# EAGLE board Protoboard MX3-11-8-ESP12 (EAGLE 7.7.0)
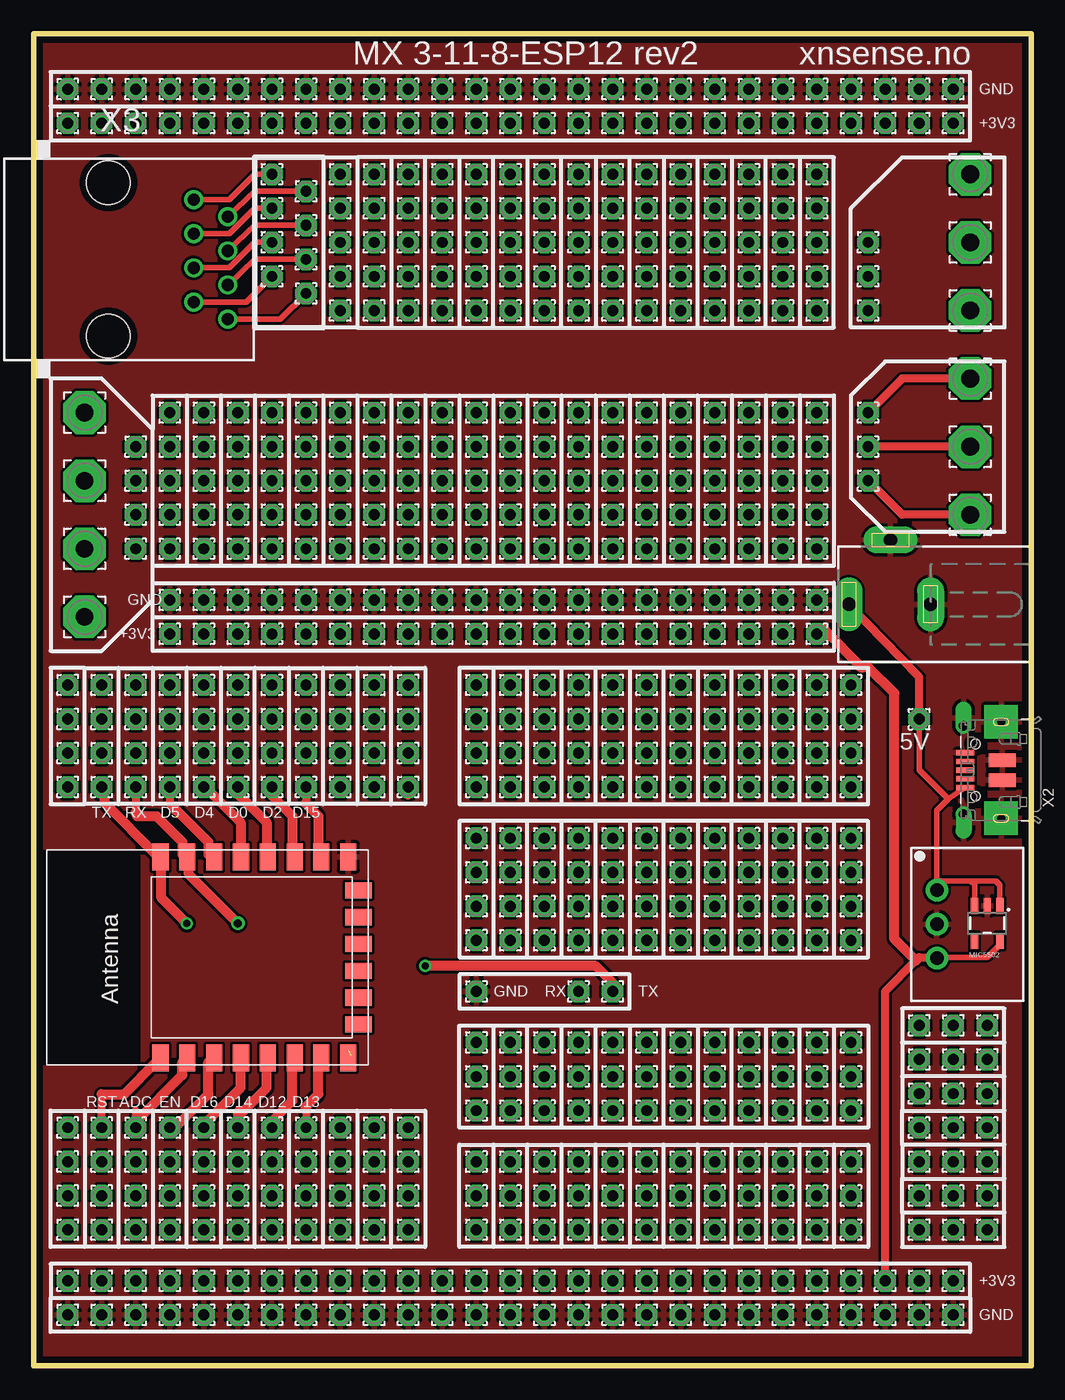
[diagram p1: board, top side]
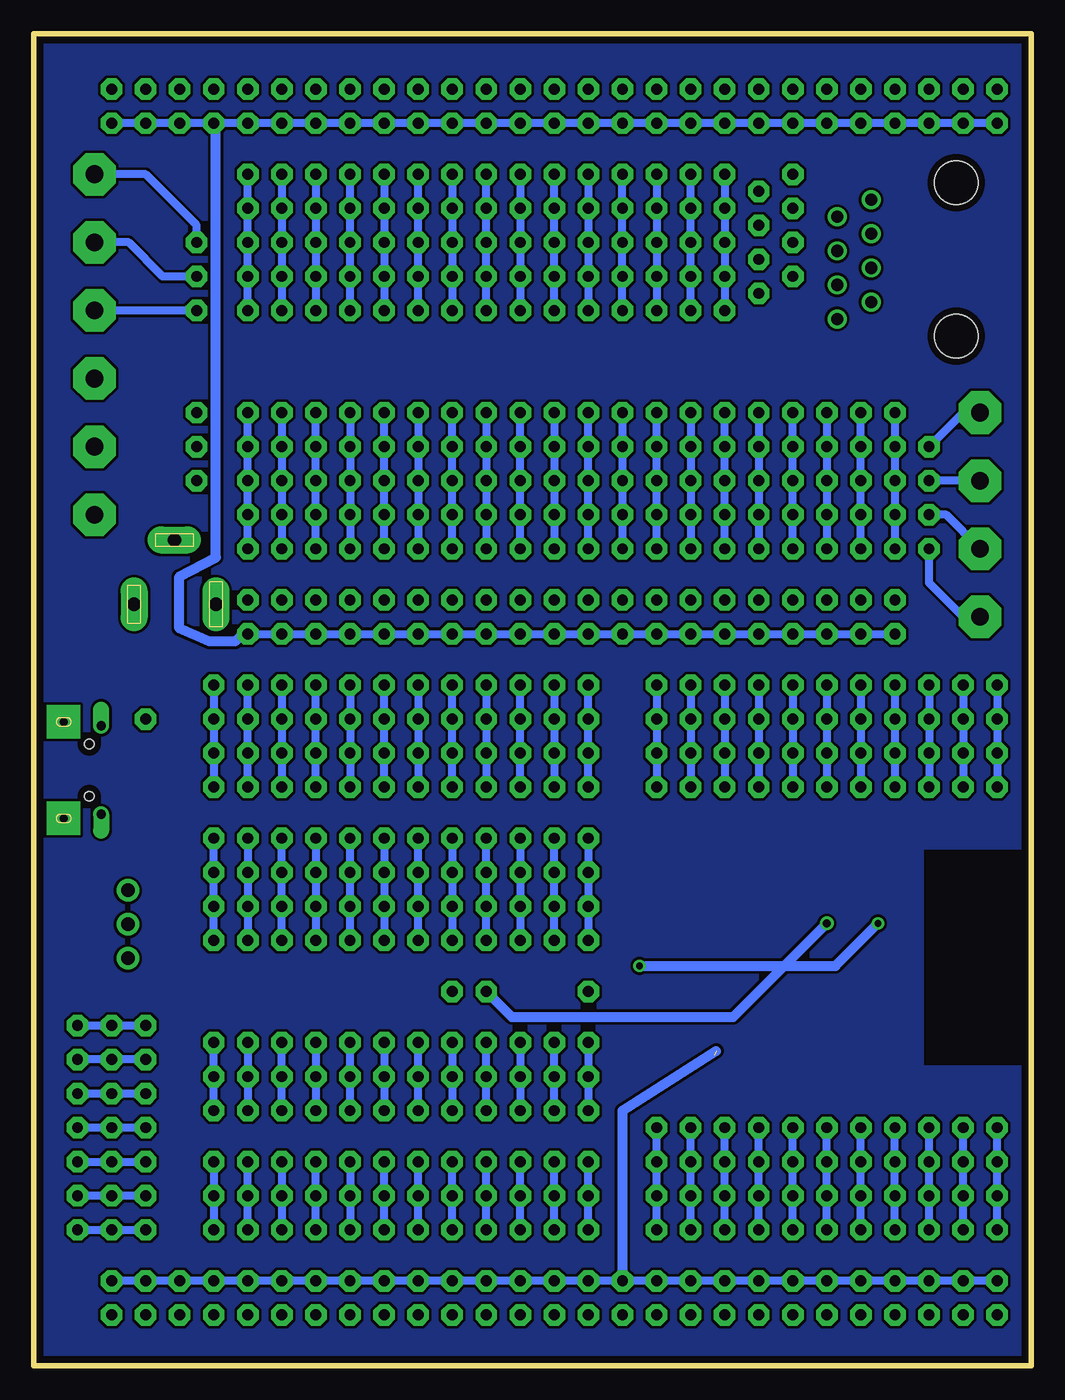
[diagram p2: board, bottom side, seen from below]

Size 74.4 x 99.4 mm. Coordinates in mm from the lower left corner, seen from the top.
Outline: 0,0 0,99.4 74.4,99.4 74.4,0 0,0
Copper layers (1*16): Top 0.035mm / dielectric 1.5mm / Bottom 0.035mm
Design rules "default *": minimum track width 30mil, minimum drill 20mil, track to track 8mil, track to pad 8mil, pad to pad 8mil, via to via 8mil, smd to smd 8mil, copper to edge 20mil, drill to drill 8mil, minimum pad ring 10mil, minimum via ring 8mil, stop-mask expansion 4mil, vias tented up to drill 0mil, thermal gap 10mil
Net classes: 0 default: width 0.61 mm, drill 0.508 mm, clearance 0.127 mm

## Footprints (pad centres in the part's own frame; a part is rotated, then mirrored left to right if it is on the bottom)
1,6/0,8 = drill 0.813 pad 1.6 octagon: 1 0,0
SIP3 = drill 1 pad 1.676: 1 -2.54,0; 2 0,0; 3 2.54,0
DCJ0202 = drill 1 pad 2 long: 1 0,3.1; 2 4.8,0; 3 0,-3
SOT23-5 = smd 0.55 x 1.2: 1 -0.95,-1.3; 2 0,-1.3; 3 0.95,-1.3; 4 0.95,1.3; 5 -0.95,1.3
3,17/1,3 = drill 1.321 pad 3.175 octagon: 1 0,0
ESP-12E = smd 2 x 1.2: 1 -7.5,5.77; 2 -7.5,3.77; 3 -7.5,1.77; 4 -7.5,-0.23; 5 -7.5,-2.23; 6 -7.5,-4.23; 7 -7.5,-6.23; 8 -7.5,-8.23; 9 7.5,-8.23; 10 7.5,-6.23; 11 7.5,-4.23; 12 7.5,-2.23; 13 7.5,-0.23; 14 7.5,1.77; 15 7.5,3.77; 16 7.5,5.77 | smd 1.2 x 2: 17 -5,-9; 18 -3,-9; 19 -1,-9; 20 1,-9; 21 3,-9; 22 5,-9
4UCONN_20329 = smd 1 x 2: BASE@1 -0.75,-2; BASE@2 0.75,-2 | smd 0.4 x 1.35: D+ 0,0.775; D- -0.65,0.775; GND 1.3,0.775; ID 0.65,0.775; VBUS -1.3,0.775 | drill 0.7 offset: SPRT@1 -3.3,0.9; SPRT@2 3.3,0.9 | drill 0.6 pad 2.5 square: SPRT@3 -3.6,-1.9; SPRT@4 3.6,-1.9 | hole 0.7: -1.95,0; 1.95,0
RJ45-NO-SHIELD = drill 0.9 pad 1.4: 1 -4.445,6.35; 2 -3.175,8.89; 3 -1.905,6.35; 4 -0.635,8.89; 5 0.635,6.35; 6 1.905,8.89; 7 3.175,6.35; 8 4.445,8.89 | hole 3.251: -5.715,0; 5.715,0

## Placement (x,y rotation side)
1  [1,6/0,8]  20.32,80.01 0 top
2  [1,6/0,8]  17.78,88.9 0 top
4  [1,6/0,8]  17.78,86.36 0 top
5  [1,6/0,8]  20.32,85.09 0 top
5V  [1,6/0,8]  66.04,48.26 180 top
6  [1,6/0,8]  17.78,83.82 0 top
7  [1,6/0,8]  20.32,82.55 0 top
8  [1,6/0,8]  17.78,81.28 0 top
DC  R-78C1.8-1.0  [SIP3]  67.37,32.95 270 top
J1  DCJ0202  [DCJ0202]  63.9,56.81 90 top
MIC5502  [SOT23-5]  71.12,33.02 180 top
PAD1  [1,6/0,8]  40.64,45.72 0 top
PAD2  [1,6/0,8]  40.64,48.26 0 top
PAD3  [1,6/0,8]  40.64,43.18 0 top
PAD4  [1,6/0,8]  17.78,95.25 0 top
PAD5  [1,6/0,8]  38.1,92.71 0 top
PAD6  [1,6/0,8]  15.24,92.71 0 top
PAD7  [1,6/0,8]  17.78,92.71 0 top
PAD8  [1,6/0,8]  20.32,92.71 0 top
PAD9  [1,6/0,8]  35.56,92.71 0 top
PAD10  [1,6/0,8]  33.02,92.71 0 top
PAD11  [1,6/0,8]  12.7,92.71 0 top
PAD12  [1,6/0,8]  17.78,57.15 0 top
PAD13  [1,6/0,8]  7.62,92.71 0 top
PAD14  [1,6/0,8]  5.08,92.71 0 top
PAD15  [1,6/0,8]  7.62,66.04 0 top
PAD16  [1,6/0,8]  40.64,92.71 0 top
PAD17  [1,6/0,8]  15.24,95.25 0 top
PAD18  [1,6/0,8]  27.94,92.71 0 top
PAD19  [1,6/0,8]  22.86,92.71 0 top
PAD20  [1,6/0,8]  10.16,92.71 0 top
PAD21  [1,6/0,8]  25.4,92.71 0 top
PAD22  [1,6/0,8]  27.94,95.25 0 top
PAD23  [1,6/0,8]  38.1,95.25 0 top
PAD24  [1,6/0,8]  5.08,95.25 0 top
PAD25  [1,6/0,8]  25.4,95.25 0 top
PAD26  [1,6/0,8]  40.64,95.25 0 top
PAD27  [1,6/0,8]  7.62,95.25 0 top
PAD28  [1,6/0,8]  22.86,95.25 0 top
PAD29  [1,6/0,8]  35.56,95.25 0 top
PAD30  [1,6/0,8]  10.16,95.25 0 top
PAD31  [1,6/0,8]  20.32,95.25 0 top
PAD32  [1,6/0,8]  33.02,95.25 0 top
PAD33  [1,6/0,8]  12.7,95.25 0 top
PAD34  [1,6/0,8]  40.64,31.75 0 top
PAD35  [1,6/0,8]  40.64,34.29 0 top
PAD36  [1,6/0,8]  12.7,57.15 0 top
PAD37  [1,6/0,8]  40.64,36.83 0 top
PAD38  [1,6/0,8]  30.48,95.25 0 top
PAD39  [1,6/0,8]  7.62,68.58 0 top
PAD40  [1,6/0,8]  40.64,39.37 0 top
PAD41  [1,6/0,8]  7.62,60.96 0 top
PAD42  [1,6/0,8]  7.62,63.5 0 top
PAD45  [1,6/0,8]  71.12,10.16 0 top
PAD46  [1,6/0,8]  68.58,10.16 0 top
PAD47  [1,6/0,8]  66.04,10.16 0 top
PAD48  [1,6/0,8]  10.16,68.58 0 top
PAD52  [1,6/0,8]  10.16,60.96 0 top
PAD53  [1,6/0,8]  10.16,71.12 0 top
PAD54  [1,6/0,8]  33.02,27.94 0 top
PAD55  [1,6/0,8]  10.16,66.04 0 top
PAD59  [1,6/0,8]  66.04,22.86 0 top
PAD60  [1,6/0,8]  68.58,22.86 0 top
PAD61  [1,6/0,8]  71.12,22.86 0 top
PAD62  [1,6/0,8]  10.16,63.5 0 top
PAD63  [1,6/0,8]  66.04,25.4 0 top
PAD64  [1,6/0,8]  71.12,25.4 0 top
PAD65  [1,6/0,8]  68.58,25.4 0 top
PAD66  [1,6/0,8]  66.04,15.24 0 top
PAD67  [1,6/0,8]  68.58,15.24 0 top
PAD68  [1,6/0,8]  71.12,15.24 0 top
PAD69  [1,6/0,8]  12.7,68.58 0 top
PAD70  [1,6/0,8]  71.12,12.7 0 top
PAD71  [1,6/0,8]  68.58,12.7 0 top
PAD72  [1,6/0,8]  66.04,12.7 0 top
PAD73  [1,6/0,8]  66.04,20.32 0 top
PAD74  [1,6/0,8]  71.12,20.32 0 top
PAD75  [1,6/0,8]  68.58,20.32 0 top
PAD76  [1,6/0,8]  12.7,60.96 0 top
PAD77  [1,6/0,8]  68.58,17.78 0 top
PAD78  [1,6/0,8]  71.12,17.78 0 top
PAD79  [1,6/0,8]  38.1,24.13 0 top
PAD80  [1,6/0,8]  38.1,21.59 0 top
PAD81  [1,6/0,8]  38.1,19.05 0 top
PAD82  [1,6/0,8]  12.7,66.04 0 top
PAD83  [1,6/0,8]  38.1,12.7 0 top
PAD84  [1,6/0,8]  38.1,10.16 0 top
PAD85  [1,6/0,8]  38.1,15.24 0 top
PAD86  [1,6/0,8]  66.04,17.78 0 top
PAD88  [1,6/0,8]  40.64,24.13 0 top
PAD89  [1,6/0,8]  40.64,21.59 0 top
PAD90  [1,6/0,8]  40.64,19.05 0 top
PAD91  [1,6/0,8]  12.7,63.5 0 top
PAD92  [1,6/0,8]  40.64,10.16 0 top
PAD93  [1,6/0,8]  40.64,12.7 0 top
PAD94  [1,6/0,8]  40.64,15.24 0 top
PAD97  [1,6/0,8]  33.02,15.24 0 top
PAD98  [1,6/0,8]  33.02,12.7 0 top
PAD99  [1,6/0,8]  33.02,10.16 0 top
PAD100  [1,6/0,8]  12.7,71.12 0 top
PAD101  [1,6/0,8]  33.02,24.13 0 top
PAD102  [1,6/0,8]  33.02,21.59 0 top
PAD103  [1,6/0,8]  33.02,19.05 0 top
PAD106  [1,6/0,8]  35.56,19.05 0 top
PAD107  [1,6/0,8]  35.56,21.59 0 top
PAD108  [1,6/0,8]  35.56,24.13 0 top
PAD109  [1,6/0,8]  10.16,54.61 0 top
PAD110  [1,6/0,8]  35.56,15.24 0 top
PAD111  [1,6/0,8]  35.56,12.7 0 top
PAD112  [1,6/0,8]  35.56,10.16 0 top
PAD115  [1,6/0,8]  43.18,21.59 0 top
PAD116  [1,6/0,8]  43.18,19.05 0 top
PAD117  [1,6/0,8]  43.18,24.13 0 top
PAD118  [1,6/0,8]  10.16,57.15 0 top
PAD119  [1,6/0,8]  43.18,10.16 0 top
PAD120  [1,6/0,8]  43.18,12.7 0 top
PAD121  [1,6/0,8]  43.18,15.24 0 top
PAD122  [1,6/0,8]  2.54,48.26 0 top
PAD123  [1,6/0,8]  2.54,45.72 0 top
PAD124  [1,6/0,8]  53.34,15.24 0 top
PAD125  [1,6/0,8]  53.34,12.7 0 top
PAD126  [1,6/0,8]  53.34,10.16 0 top
PAD128  [1,6/0,8]  53.34,24.13 0 top
PAD129  [1,6/0,8]  53.34,21.59 0 top
PAD130  [1,6/0,8]  53.34,19.05 0 top
PAD131  [1,6/0,8]  2.54,43.18 0 top
PAD132  [1,6/0,8]  2.54,50.8 0 top
PAD133  [1,6/0,8]  55.88,19.05 0 top
PAD134  [1,6/0,8]  55.88,21.59 0 top
PAD135  [1,6/0,8]  55.88,24.13 0 top
PAD137  [1,6/0,8]  55.88,15.24 0 top
PAD138  [1,6/0,8]  55.88,10.16 0 top
PAD139  [1,6/0,8]  55.88,12.7 0 top
PAD140  [1,6/0,8]  27.94,57.15 0 top
PAD141  [1,6/0,8]  30.48,57.15 0 top
PAD142  [1,6/0,8]  58.42,15.24 0 top
PAD143  [1,6/0,8]  58.42,12.7 0 top
PAD144  [1,6/0,8]  58.42,10.16 0 top
PAD146  [1,6/0,8]  58.42,24.13 0 top
PAD147  [1,6/0,8]  58.42,21.59 0 top
PAD148  [1,6/0,8]  58.42,19.05 0 top
PAD149  [1,6/0,8]  43.18,57.15 0 top
PAD150  [1,6/0,8]  43.18,48.26 0 top
PAD151  [1,6/0,8]  60.96,21.59 0 top
PAD152  [1,6/0,8]  60.96,19.05 0 top
PAD153  [1,6/0,8]  60.96,24.13 0 top
PAD155  [1,6/0,8]  60.96,15.24 0 top
PAD156  [1,6/0,8]  60.96,10.16 0 top
PAD157  [1,6/0,8]  60.96,12.7 0 top
PAD158  [1,6/0,8]  43.18,45.72 0 top
PAD159  [1,6/0,8]  43.18,43.18 0 top
PAD160  [1,6/0,8]  45.72,15.24 0 top
PAD161  [1,6/0,8]  45.72,10.16 0 top
PAD162  [1,6/0,8]  45.72,12.7 0 top
PAD164  [1,6/0,8]  45.72,19.05 0 top
PAD165  [1,6/0,8]  45.72,21.59 0 top
PAD166  [1,6/0,8]  45.72,24.13 0 top
PAD167  [1,6/0,8]  43.18,31.75 0 top
PAD168  [1,6/0,8]  43.18,36.83 0 top
PAD169  [1,6/0,8]  50.8,19.05 0 top
PAD170  [1,6/0,8]  50.8,21.59 0 top
PAD171  [1,6/0,8]  50.8,24.13 0 top
PAD173  [1,6/0,8]  50.8,15.24 0 top
PAD174  [1,6/0,8]  50.8,10.16 0 top
PAD175  [1,6/0,8]  50.8,12.7 0 top
PAD176  [1,6/0,8]  43.18,39.37 0 top
PAD177  [1,6/0,8]  43.18,34.29 0 top
PAD178  [1,6/0,8]  48.26,15.24 0 top
PAD179  [1,6/0,8]  48.26,10.16 0 top
PAD180  [1,6/0,8]  48.26,12.7 0 top
PAD182  [1,6/0,8]  48.26,19.05 0 top
PAD183  [1,6/0,8]  48.26,21.59 0 top
PAD184  [1,6/0,8]  48.26,24.13 0 top
PAD185  [1,6/0,8]  45.72,31.75 0 top
PAD186  [1,6/0,8]  45.72,36.83 0 top
PAD194  [1,6/0,8]  45.72,34.29 0 top
PAD195  [1,6/0,8]  45.72,48.26 0 top
PAD196  [1,6/0,8]  33.02,34.29 0 top
PAD197  [1,6/0,8]  33.02,36.83 0 top
PAD198  [1,6/0,8]  33.02,39.37 0 top
PAD199  [1,6/0,8]  33.02,43.18 0 top
PAD200  [1,6/0,8]  33.02,45.72 0 top
PAD201  [1,6/0,8]  33.02,48.26 0 top
PAD202  [1,6/0,8]  33.02,50.8 0 top
PAD203  [1,6/0,8]  45.72,50.8 0 top
PAD204  [1,6/0,8]  45.72,45.72 0 top
PAD205  [1,6/0,8]  38.1,43.18 0 top
PAD206  [1,6/0,8]  38.1,45.72 0 top
PAD207  [1,6/0,8]  38.1,48.26 0 top
PAD208  [1,6/0,8]  38.1,31.75 0 top
PAD209  [1,6/0,8]  38.1,36.83 0 top
PAD210  [1,6/0,8]  38.1,39.37 0 top
PAD211  [1,6/0,8]  38.1,34.29 0 top
PAD212  [1,6/0,8]  45.72,43.18 0 top
PAD213  [1,6/0,8]  48.26,48.26 0 top
PAD214  [1,6/0,8]  35.56,45.72 0 top
PAD215  [1,6/0,8]  35.56,43.18 0 top
PAD216  [1,6/0,8]  35.56,48.26 0 top
PAD217  [1,6/0,8]  35.56,36.83 0 top
PAD218  [1,6/0,8]  35.56,39.37 0 top
PAD219  [1,6/0,8]  35.56,34.29 0 top
PAD220  [1,6/0,8]  35.56,31.75 0 top
PAD221  [1,6/0,8]  48.26,43.18 0 top
PAD222  [1,6/0,8]  48.26,45.72 0 top
PAD223  [1,6/0,8]  48.26,36.83 0 top
PAD224  [1,6/0,8]  48.26,31.75 0 top
PAD225  [1,6/0,8]  48.26,34.29 0 top
PAD226  [1,6/0,8]  48.26,39.37 0 top
PAD227  [1,6/0,8]  50.8,36.83 0 top
PAD228  [1,6/0,8]  50.8,34.29 0 top
PAD229  [1,6/0,8]  50.8,31.75 0 top
PAD230  [1,6/0,8]  50.8,48.26 0 top
PAD231  [1,6/0,8]  50.8,45.72 0 top
PAD232  [1,6/0,8]  50.8,43.18 0 top
PAD233  [1,6/0,8]  50.8,50.8 0 top
PAD234  [1,6/0,8]  53.34,48.26 0 top
PAD235  [1,6/0,8]  53.34,43.18 0 top
PAD236  [1,6/0,8]  53.34,45.72 0 top
PAD237  [1,6/0,8]  53.34,39.37 0 top
PAD238  [1,6/0,8]  53.34,31.75 0 top
PAD239  [1,6/0,8]  53.34,34.29 0 top
PAD240  [1,6/0,8]  53.34,36.83 0 top
PAD241  [3,17/1,3]  3.81,60.96 0 top
PAD242  [3,17/1,3]  3.81,55.88 0 top
PAD243  [3,17/1,3]  3.81,71.12 0 top
PAD244  [3,17/1,3]  3.81,66.04 0 top
PAD249  [1,6/0,8]  50.8,57.15 0 top
PAD250  [1,6/0,8]  25.4,88.9 0 top
PAD251  [1,6/0,8]  25.4,86.36 0 top
PAD252  [1,6/0,8]  25.4,83.82 0 top
PAD253  [1,6/0,8]  25.4,81.28 0 top
PAD254  [1,6/0,8]  25.4,78.74 0 top
PAD255  [1,6/0,8]  53.34,57.15 0 top
PAD256  [1,6/0,8]  5.08,43.18 0 top
PAD257  [1,6/0,8]  5.08,45.72 0 top
PAD258  [1,6/0,8]  5.08,48.26 0 top
PAD259  TX  [1,6/0,8]  5.08,50.8 0 top
PAD267  [1,6/0,8]  7.62,43.18 0 top
PAD268  [1,6/0,8]  7.62,50.8 0 top
PAD276  [1,6/0,8]  50.8,3.81 0 top
PAD277  [1,6/0,8]  53.34,3.81 0 top
PAD285  [1,6/0,8]  55.88,3.81 0 top
PAD286  [1,6/0,8]  58.42,3.81 0 top
PAD294  [1,6/0,8]  50.8,6.35 0 top
PAD295  [1,6/0,8]  53.34,6.35 0 top
PAD303  [1,6/0,8]  55.88,6.35 0 top
PAD304  [1,6/0,8]  58.42,6.35 0 top
PAD312  [1,6/0,8]  43.18,92.71 0 top
PAD313  [1,6/0,8]  45.72,92.71 0 top
PAD321  [1,6/0,8]  48.26,92.71 0 top
PAD322  [1,6/0,8]  50.8,92.71 0 top
PAD323  [1,6/0,8]  53.34,92.71 0 top
PAD324  [1,6/0,8]  55.88,92.71 0 top
PAD325  [1,6/0,8]  58.42,92.71 0 top
PAD326  [1,6/0,8]  43.18,95.25 0 top
PAD327  [1,6/0,8]  45.72,95.25 0 top
PAD328  [1,6/0,8]  48.26,95.25 0 top
PAD329  [1,6/0,8]  50.8,95.25 0 top
PAD330  [1,6/0,8]  53.34,95.25 0 top
PAD331  [1,6/0,8]  55.88,95.25 0 top
PAD339  [1,6/0,8]  58.42,95.25 0 top
PAD340  [1,6/0,8]  55.88,48.26 0 top
PAD348  [1,6/0,8]  55.88,43.18 0 top
PAD349  [1,6/0,8]  55.88,45.72 0 top
PAD357  [1,6/0,8]  55.88,36.83 0 top
PAD358  [1,6/0,8]  55.88,31.75 0 top
PAD366  [1,6/0,8]  55.88,39.37 0 top
PAD367  [1,6/0,8]  55.88,34.29 0 top
PAD375  [1,6/0,8]  58.42,48.26 0 top
PAD376  [1,6/0,8]  58.42,45.72 0 top
PAD384  [1,6/0,8]  58.42,43.18 0 top
PAD390  [1,6/0,8]  58.42,31.75 0 top
PAD395  [1,6/0,8]  58.42,39.37 0 top
PAD396  [1,6/0,8]  7.62,48.26 0 top
PAD397  RX  [1,6/0,8]  7.62,45.72 0 top
PAD398  [1,6/0,8]  10.16,43.18 0 top
PAD399  [1,6/0,8]  10.16,45.72 0 top
PAD400  [1,6/0,8]  10.16,48.26 0 top
PAD401  5  [1,6/0,8]  10.16,50.8 0 top
PAD402  [1,6/0,8]  12.7,48.26 0 top
PAD403  [1,6/0,8]  12.7,45.72 0 top
PAD404  [1,6/0,8]  12.7,43.18 0 top
PAD405  4  [1,6/0,8]  12.7,50.8 0 top
PAD406  [1,6/0,8]  15.24,43.18 0 top
PAD407  [1,6/0,8]  15.24,45.72 0 top
PAD408  [1,6/0,8]  15.24,48.26 0 top
PAD409  0  [1,6/0,8]  15.24,50.8 0 top
PAD410  [1,6/0,8]  17.78,50.8 0 top
PAD411  [1,6/0,8]  17.78,43.18 0 top
PAD412  [1,6/0,8]  17.78,48.26 0 top
PAD413  2  [1,6/0,8]  17.78,45.72 0 top
PAD414  [1,6/0,8]  58.42,36.83 0 top
PAD415  [1,6/0,8]  58.42,34.29 0 top
PAD416  [1,6/0,8]  60.96,43.18 0 top
PAD417  [1,6/0,8]  20.32,43.18 0 top
PAD418  [1,6/0,8]  20.32,45.72 0 top
PAD419  [1,6/0,8]  20.32,50.8 0 top
PAD420  [1,6/0,8]  60.96,45.72 0 top
PAD421  [1,6/0,8]  17.78,3.81 0 top
PAD422  [1,6/0,8]  22.86,3.81 0 top
PAD423  [1,6/0,8]  10.16,3.81 0 top
PAD424  [1,6/0,8]  5.08,3.81 0 top
PAD425  [1,6/0,8]  40.64,3.81 0 top
PAD426  [1,6/0,8]  12.7,3.81 0 top
PAD427  [1,6/0,8]  7.62,3.81 0 top
PAD428  [1,6/0,8]  48.26,3.81 0 top
PAD429  [1,6/0,8]  15.24,3.81 0 top
PAD430  [1,6/0,8]  35.56,3.81 0 top
PAD431  [1,6/0,8]  45.72,3.81 0 top
PAD432  [1,6/0,8]  25.4,57.15 0 top
PAD433  [1,6/0,8]  38.1,3.81 0 top
PAD434  [1,6/0,8]  43.18,3.81 0 top
PAD435  [1,6/0,8]  20.32,3.81 0 top
PAD436  [1,6/0,8]  33.02,3.81 0 top
PAD437  [1,6/0,8]  60.96,48.26 0 top
PAD438  [1,6/0,8]  60.96,34.29 0 top
PAD439  [1,6/0,8]  30.48,3.81 0 top
PAD440  [1,6/0,8]  27.94,3.81 0 top
PAD441  [1,6/0,8]  25.4,3.81 0 top
PAD442  [1,6/0,8]  25.4,6.35 0 top
PAD443  [1,6/0,8]  38.1,6.35 0 top
PAD444  [1,6/0,8]  5.08,6.35 0 top
PAD445  [1,6/0,8]  40.64,6.35 0 top
PAD446  [1,6/0,8]  35.56,6.35 0 top
PAD447  [1,6/0,8]  33.02,57.15 0 top
PAD448  [1,6/0,8]  48.26,6.35 0 top
PAD449  [1,6/0,8]  33.02,6.35 0 top
PAD450  [1,6/0,8]  7.62,6.35 0 top
PAD451  [1,6/0,8]  45.72,6.35 0 top
PAD452  [1,6/0,8]  30.48,6.35 0 top
PAD453  [1,6/0,8]  10.16,6.35 0 top
PAD454  [1,6/0,8]  43.18,6.35 0 top
PAD455  [1,6/0,8]  27.94,6.35 0 top
PAD456  [1,6/0,8]  12.7,6.35 0 top
PAD457  [1,6/0,8]  60.96,39.37 0 top
PAD458  [1,6/0,8]  60.96,31.75 0 top
PAD459  [1,6/0,8]  15.24,6.35 0 top
PAD460  [1,6/0,8]  22.86,6.35 0 top
PAD461  [1,6/0,8]  20.32,6.35 0 top
PAD462  [1,6/0,8]  17.78,6.35 0 top
PAD463  [1,6/0,8]  60.96,36.83 0 top
PAD471  [1,6/0,8]  40.64,57.15 0 top
PAD472  [1,6/0,8]  48.26,57.15 0 top
PAD473  [1,6/0,8]  55.88,57.15 0 top
PAD474  [1,6/0,8]  22.86,57.15 0 top
PAD475  [1,6/0,8]  35.56,57.15 0 top
PAD476  [1,6/0,8]  38.1,57.15 0 top
PAD477  [1,6/0,8]  45.72,57.15 0 top
PAD478  [1,6/0,8]  58.42,57.15 0 top
PAD479  [1,6/0,8]  20.32,57.15 0 top
PAD480  [1,6/0,8]  40.64,54.61 0 top
PAD481  [1,6/0,8]  35.56,54.61 0 top
PAD482  [1,6/0,8]  50.8,54.61 0 top
PAD483  [1,6/0,8]  53.34,54.61 0 top
PAD484  [1,6/0,8]  20.32,54.61 0 top
PAD485  [1,6/0,8]  22.86,54.61 0 top
PAD486  [1,6/0,8]  33.02,54.61 0 top
PAD487  [1,6/0,8]  48.26,54.61 0 top
PAD488  [1,6/0,8]  55.88,54.61 0 top
PAD489  [1,6/0,8]  17.78,54.61 0 top
PAD490  [1,6/0,8]  43.18,54.61 0 top
PAD491  [1,6/0,8]  15.24,63.5 0 top
PAD492  [1,6/0,8]  15.24,60.96 0 top
PAD493  [1,6/0,8]  15.24,66.04 0 top
PAD494  [1,6/0,8]  15.24,68.58 0 top
PAD495  [1,6/0,8]  15.24,71.12 0 top
PAD496  [1,6/0,8]  30.48,54.61 0 top
PAD497  [1,6/0,8]  45.72,54.61 0 top
PAD498  [1,6/0,8]  17.78,66.04 0 top
PAD499  [1,6/0,8]  17.78,63.5 0 top
PAD500  [1,6/0,8]  17.78,60.96 0 top
PAD501  [1,6/0,8]  17.78,68.58 0 top
PAD502  [1,6/0,8]  17.78,71.12 0 top
PAD503  [1,6/0,8]  58.42,54.61 0 top
PAD504  [1,6/0,8]  15.24,54.61 0 top
PAD505  [1,6/0,8]  20.32,68.58 0 top
PAD506  [1,6/0,8]  20.32,66.04 0 top
PAD507  [1,6/0,8]  20.32,63.5 0 top
PAD508  [1,6/0,8]  20.32,60.96 0 top
PAD509  [1,6/0,8]  20.32,71.12 0 top
PAD510  [1,6/0,8]  12.7,54.61 0 top
PAD511  [1,6/0,8]  27.94,54.61 0 top
PAD512  [1,6/0,8]  22.86,71.12 0 top
PAD513  [1,6/0,8]  22.86,60.96 0 top
PAD514  [1,6/0,8]  22.86,68.58 0 top
PAD515  [1,6/0,8]  22.86,66.04 0 top
PAD516  [1,6/0,8]  22.86,63.5 0 top
PAD517  [1,6/0,8]  38.1,54.61 0 top
PAD518  [1,6/0,8]  22.86,88.9 0 top
PAD519  [1,6/0,8]  25.4,63.5 0 top
PAD520  [1,6/0,8]  25.4,60.96 0 top
PAD521  [1,6/0,8]  25.4,66.04 0 top
PAD522  [1,6/0,8]  25.4,68.58 0 top
PAD523  [1,6/0,8]  25.4,71.12 0 top
PAD524  [1,6/0,8]  22.86,86.36 0 top
PAD525  [1,6/0,8]  15.24,57.15 0 top
PAD526  [1,6/0,8]  27.94,66.04 0 top
PAD527  [1,6/0,8]  27.94,63.5 0 top
PAD528  [1,6/0,8]  27.94,60.96 0 top
PAD529  [1,6/0,8]  27.94,68.58 0 top
PAD530  [1,6/0,8]  27.94,71.12 0 top
PAD531  [1,6/0,8]  22.86,83.82 0 top
PAD532  [1,6/0,8]  22.86,81.28 0 top
PAD533  [1,6/0,8]  30.48,68.58 0 top
PAD534  [1,6/0,8]  30.48,66.04 0 top
PAD535  [1,6/0,8]  30.48,63.5 0 top
PAD536  [1,6/0,8]  30.48,60.96 0 top
PAD537  [1,6/0,8]  30.48,71.12 0 top
PAD538  [1,6/0,8]  22.86,78.74 0 top
PAD539  [1,6/0,8]  25.4,54.61 0 top
PAD540  [1,6/0,8]  33.02,71.12 0 top
PAD541  [1,6/0,8]  33.02,66.04 0 top
PAD542  [1,6/0,8]  33.02,68.58 0 top
PAD543  [1,6/0,8]  33.02,60.96 0 top
PAD544  [1,6/0,8]  33.02,63.5 0 top
PAD547  [1,6/0,8]  35.56,66.04 0 top
PAD548  [1,6/0,8]  35.56,68.58 0 top
PAD549  [1,6/0,8]  35.56,71.12 0 top
PAD550  [1,6/0,8]  35.56,60.96 0 top
PAD551  [1,6/0,8]  35.56,63.5 0 top
PAD554  [1,6/0,8]  38.1,60.96 0 top
PAD555  [1,6/0,8]  38.1,63.5 90 top
PAD556  [1,6/0,8]  38.1,66.04 0 top
PAD557  [1,6/0,8]  38.1,68.58 0 top
PAD558  [1,6/0,8]  38.1,71.12 0 top
PAD560  [1,6/0,8]  2.54,17.78 0 top
PAD561  [1,6/0,8]  40.64,60.96 0 top
PAD562  [1,6/0,8]  40.64,63.5 0 top
PAD563  [1,6/0,8]  40.64,66.04 0 top
PAD564  [1,6/0,8]  40.64,68.58 0 top
PAD565  [1,6/0,8]  40.64,71.12 0 top
PAD566  [1,6/0,8]  2.54,15.24 0 top
PAD567  [1,6/0,8]  2.54,12.7 0 top
PAD568  [1,6/0,8]  43.18,68.58 0 top
PAD569  [1,6/0,8]  43.18,71.12 0 top
PAD570  [1,6/0,8]  43.18,60.96 0 top
PAD571  [1,6/0,8]  43.18,63.5 0 top
PAD572  [1,6/0,8]  43.18,66.04 0 top
PAD573  [1,6/0,8]  2.54,10.16 0 top
PAD574  [1,6/0,8]  33.02,31.75 0 top
PAD575  [1,6/0,8]  45.72,68.58 0 top
PAD576  [1,6/0,8]  45.72,71.12 0 top
PAD577  [1,6/0,8]  45.72,63.5 0 top
PAD578  [1,6/0,8]  45.72,66.04 0 top
PAD579  [1,6/0,8]  45.72,60.96 0 top
PAD580  [1,6/0,8]  38.1,50.8 0 top
PAD581  [1,6/0,8]  35.56,50.8 0 top
PAD582  [1,6/0,8]  48.26,63.5 0 top
PAD583  [1,6/0,8]  48.26,66.04 0 top
PAD584  [1,6/0,8]  48.26,68.58 0 top
PAD585  [1,6/0,8]  48.26,71.12 0 top
PAD586  [1,6/0,8]  48.26,60.96 0 top
PAD587  [1,6/0,8]  40.64,50.8 0 top
PAD588  [1,6/0,8]  43.18,50.8 0 top
PAD589  [1,6/0,8]  50.8,60.96 0 top
PAD590  [1,6/0,8]  50.8,63.5 0 top
PAD591  [1,6/0,8]  50.8,66.04 0 top
PAD592  [1,6/0,8]  50.8,68.58 0 top
PAD593  [1,6/0,8]  50.8,71.12 0 top
PAD594  [1,6/0,8]  45.72,39.37 0 top
PAD595  [1,6/0,8]  48.26,50.8 0 top
PAD596  [1,6/0,8]  53.34,71.12 0 top
PAD597  [1,6/0,8]  53.34,60.96 0 top
PAD598  [1,6/0,8]  53.34,63.5 0 top
PAD599  [1,6/0,8]  53.34,66.04 0 top
PAD600  [1,6/0,8]  53.34,68.58 0 top
PAD601  [1,6/0,8]  50.8,39.37 0 top
PAD602  [1,6/0,8]  53.34,50.8 0 top
PAD603  [1,6/0,8]  55.88,71.12 0 top
PAD604  [1,6/0,8]  55.88,66.04 0 top
PAD605  [1,6/0,8]  55.88,68.58 0 top
PAD606  [1,6/0,8]  55.88,60.96 0 top
PAD607  [1,6/0,8]  55.88,63.5 0 top
PAD608  [1,6/0,8]  55.88,50.8 0 top
PAD609  [1,6/0,8]  58.42,50.8 0 top
PAD610  [1,6/0,8]  58.42,66.04 0 top
PAD611  [1,6/0,8]  58.42,63.5 0 top
PAD612  [1,6/0,8]  58.42,68.58 0 top
PAD613  [1,6/0,8]  58.42,71.12 0 top
PAD614  [1,6/0,8]  58.42,60.96 0 top
PAD615  [1,6/0,8]  60.96,50.8 0 top
PAD617  [1,6/0,8]  2.54,6.35 0 top
PAD618  [1,6/0,8]  66.04,6.35 0 top
PAD619  [1,6/0,8]  2.54,3.81 0 top
PAD620  [1,6/0,8]  66.04,3.81 0 top
PAD621  [1,6/0,8]  63.5,95.25 0 top
PAD622  15  [1,6/0,8]  20.32,48.26 0 top
PAD623  [1,6/0,8]  22.86,50.8 0 top
PAD624  [1,6/0,8]  22.86,48.26 0 top
PAD625  [1,6/0,8]  22.86,45.72 0 top
PAD626  SC  [1,6/0,8]  22.86,43.18 0 top
PAD627  AC  [1,6/0,8]  7.62,10.16 0 top
PAD628  [1,6/0,8]  7.62,17.78 0 top
PAD629  [1,6/0,8]  7.62,15.24 0 top
PAD630  [1,6/0,8]  7.62,12.7 0 top
PAD631  CH  [1,6/0,8]  10.16,17.78 0 top
PAD632  [1,6/0,8]  10.16,15.24 0 top
PAD633  [1,6/0,8]  10.16,12.7 0 top
PAD634  [1,6/0,8]  10.16,10.16 0 top
PAD635  16  [1,6/0,8]  12.7,17.78 0 top
PAD636  [1,6/0,8]  12.7,15.24 0 top
PAD637  [1,6/0,8]  12.7,10.16 0 top
PAD638  [1,6/0,8]  12.7,12.7 0 top
PAD639  14  [1,6/0,8]  15.24,15.24 0 top
PAD640  [1,6/0,8]  15.24,12.7 0 top
PAD641  [1,6/0,8]  15.24,10.16 0 top
PAD642  [1,6/0,8]  15.24,17.78 0 top
PAD643  [1,6/0,8]  2.54,95.25 0 top
PAD644  [1,6/0,8]  58.42,81.28 0 top
PAD645  [1,6/0,8]  58.42,83.82 0 top
PAD646  [1,6/0,8]  58.42,86.36 0 top
PAD647  [1,6/0,8]  58.42,88.9 0 top
PAD648  [1,6/0,8]  58.42,78.74 0 top
PAD649  [1,6/0,8]  30.48,92.71 0 top
PAD650  [1,6/0,8]  2.54,92.71 0 top
PAD651  [1,6/0,8]  55.88,83.82 0 top
PAD652  [1,6/0,8]  55.88,86.36 0 top
PAD653  [1,6/0,8]  55.88,88.9 0 top
PAD654  [1,6/0,8]  55.88,81.28 0 top
PAD655  [1,6/0,8]  55.88,78.74 0 top
PAD656  [1,6/0,8]  62.23,83.82 0 top
PAD657  [1,6/0,8]  62.23,66.04 0 top
PAD658  [1,6/0,8]  53.34,86.36 0 top
PAD659  [1,6/0,8]  53.34,88.9 0 top
PAD660  [1,6/0,8]  53.34,83.82 0 top
PAD661  [1,6/0,8]  53.34,81.28 0 top
PAD662  [1,6/0,8]  53.34,78.74 0 top
PAD663  [1,6/0,8]  62.23,81.28 0 top
PAD664  [1,6/0,8]  62.23,78.74 0 top
PAD665  [1,6/0,8]  50.8,88.9 0 top
PAD666  [1,6/0,8]  50.8,86.36 0 top
PAD667  [1,6/0,8]  50.8,83.82 0 top
PAD668  [1,6/0,8]  50.8,78.74 0 top
PAD669  [1,6/0,8]  50.8,81.28 0 top
PAD670  [1,6/0,8]  62.23,71.12 0 top
PAD671  [1,6/0,8]  62.23,68.58 0 top
PAD672  [1,6/0,8]  48.26,88.9 0 top
PAD673  [1,6/0,8]  48.26,86.36 0 top
PAD674  [1,6/0,8]  48.26,78.74 0 top
PAD675  [1,6/0,8]  48.26,81.28 0 top
PAD676  [1,6/0,8]  48.26,83.82 0 top
PAD679  [1,6/0,8]  45.72,88.9 0 top
PAD680  [1,6/0,8]  45.72,78.74 0 top
PAD681  [1,6/0,8]  45.72,81.28 0 top
PAD682  [1,6/0,8]  45.72,83.82 0 top
PAD683  [1,6/0,8]  45.72,86.36 0 top
PAD686  [1,6/0,8]  43.18,81.28 0 top
PAD687  [1,6/0,8]  43.18,83.82 0 top
PAD688  [1,6/0,8]  43.18,86.36 0 top
PAD689  [1,6/0,8]  43.18,88.9 0 top
PAD690  [1,6/0,8]  43.18,78.74 0 top
PAD693  [1,6/0,8]  40.64,83.82 0 top
PAD694  [1,6/0,8]  40.64,86.36 0 top
PAD695  [1,6/0,8]  40.64,88.9 0 top
PAD696  [1,6/0,8]  40.64,81.28 0 top
PAD697  [1,6/0,8]  40.64,78.74 0 top
PAD700  [1,6/0,8]  38.1,86.36 0 top
PAD701  [1,6/0,8]  38.1,88.9 0 top
PAD702  [1,6/0,8]  38.1,83.82 0 top
PAD703  [1,6/0,8]  38.1,81.28 0 top
PAD704  [1,6/0,8]  38.1,78.74 0 top
PAD707  [1,6/0,8]  35.56,88.9 0 top
PAD708  [1,6/0,8]  35.56,86.36 0 top
PAD709  [1,6/0,8]  35.56,81.28 0 top
PAD710  [1,6/0,8]  35.56,78.74 0 top
PAD711  [1,6/0,8]  35.56,83.82 0 top
PAD714  [1,6/0,8]  33.02,81.28 0 top
PAD715  [1,6/0,8]  33.02,78.74 0 top
PAD716  [1,6/0,8]  33.02,88.9 0 top
PAD717  [1,6/0,8]  33.02,83.82 0 top
PAD718  [1,6/0,8]  33.02,86.36 0 top
PAD721  [1,6/0,8]  30.48,86.36 0 top
PAD722  [1,6/0,8]  30.48,81.28 0 top
PAD723  [1,6/0,8]  30.48,83.82 0 top
PAD724  [1,6/0,8]  30.48,78.74 0 top
PAD725  [1,6/0,8]  30.48,88.9 0 top
PAD728  [1,6/0,8]  27.94,83.82 0 top
PAD729  [1,6/0,8]  27.94,81.28 0 top
PAD730  [1,6/0,8]  27.94,78.74 0 top
PAD731  [1,6/0,8]  27.94,88.9 0 top
PAD732  [1,6/0,8]  27.94,86.36 0 top
PAD734  [1,6/0,8]  68.58,95.25 0 top
PAD742  12  [1,6/0,8]  17.78,10.16 0 top
PAD743  [1,6/0,8]  17.78,12.7 0 top
PAD744  [1,6/0,8]  17.78,15.24 0 top
PAD745  [1,6/0,8]  17.78,17.78 0 top
PAD746  13  [1,6/0,8]  20.32,12.7 0 top
PAD747  [1,6/0,8]  20.32,15.24 0 top
PAD748  [1,6/0,8]  20.32,17.78 0 top
PAD749  [1,6/0,8]  20.32,10.16 0 top
PAD751  [3,17/1,3]  69.85,68.58 0 top
PAD752  [3,17/1,3]  69.85,73.66 0 top
PAD753  [3,17/1,3]  69.85,78.74 0 top
PAD754  [3,17/1,3]  69.85,83.82 0 top
PAD755  [3,17/1,3]  69.85,63.5 0 top
PAD756  [3,17/1,3]  69.85,88.9 0 top
PAD757  [1,6/0,8]  66.04,95.25 0 top
PAD758  CS  [1,6/0,8]  22.86,17.78 0 top
PAD759  [1,6/0,8]  22.86,15.24 0 top
PAD760  [1,6/0,8]  22.86,12.7 0 top
PAD761  [1,6/0,8]  22.86,10.16 0 top
PAD762  [1,6/0,8]  25.4,43.18 0 top
PAD763  [1,6/0,8]  25.4,50.8 0 top
PAD764  [1,6/0,8]  25.4,48.26 0 top
PAD765  SI  [1,6/0,8]  25.4,45.72 0 top
PAD766  [1,6/0,8]  27.94,43.18 0 top
PAD767  [1,6/0,8]  27.94,45.72 0 top
PAD768  [1,6/0,8]  27.94,48.26 0 top
PAD769  10  [1,6/0,8]  27.94,50.8 0 top
PAD770  RS  [1,6/0,8]  5.08,17.78 0 top
PAD771  [1,6/0,8]  5.08,10.16 0 top
PAD772  [1,6/0,8]  5.08,12.7 0 top
PAD773  [1,6/0,8]  5.08,15.24 0 top
PAD774  SO  [1,6/0,8]  25.4,15.24 0 top
PAD775  [1,6/0,8]  25.4,12.7 0 top
PAD776  [1,6/0,8]  25.4,10.16 0 top
PAD777  [1,6/0,8]  25.4,17.78 0 top
PAD778  9  [1,6/0,8]  27.94,10.16 0 top
PAD779  [1,6/0,8]  27.94,12.7 0 top
PAD780  [1,6/0,8]  27.94,15.24 0 top
PAD781  [1,6/0,8]  27.94,17.78 0 top
PAD783  [1,6/0,8]  60.96,95.25 0 top
PAD784  [1,6/0,8]  60.96,92.71 0 top
PAD785  [1,6/0,8]  63.5,92.71 0 top
PAD786  [1,6/0,8]  66.04,92.71 0 top
PAD787  [1,6/0,8]  68.58,92.71 0 top
PAD788  [1,6/0,8]  60.96,3.81 0 top
PAD789  [1,6/0,8]  68.58,3.81 0 top
PAD790  [1,6/0,8]  63.5,3.81 0 top
PAD792  [1,6/0,8]  60.96,6.35 0 top
PAD793  [1,6/0,8]  68.58,6.35 0 top
PAD794  [1,6/0,8]  63.5,6.35 0 top
RJ-3  [1,6/0,8]  20.32,87.63 0 top
RX  [1,6/0,8]  40.64,27.94 0 top
TX  [1,6/0,8]  43.18,27.94 0 top
X1  ESP-12E  [ESP-12E]  15.24,30.48 90 top
X2  [4UCONN_20329]  70.25,44.45 90 top
X3  RJ45  [RJ45-NO-SHIELD]  5.59,82.55 270 top

## Tracks (layer width: path | path; a pad name or v marks a point on that pad's centre or on a via)
GND
  pour Top: 0,99.4 0,0 74.4,0 74.4,99.4
N$1
  pour Bottom: 0,99.4 0,0 74.4,0 74.4,99.4
N$2
  Bottom 0.61: PAD99.1 PAD98.1 33.02,13.03 PAD97.1
  Bottom 0.762: PAD98.1 33.3,13.03 33.02,13.03
N$3
  Bottom 0.61: PAD34.1 PAD35.1 40.64,34.75 40.64,36.68 PAD37.1 PAD40.1
  Bottom 0.762: PAD35.1 40.54,34.75 40.64,34.75 | 40.64,36.68 40.54,36.68 PAD37.1
N$4
  Bottom 0.61: PAD45.1 PAD46.1 68.53,10.16 PAD47.1
  Bottom 0.762: PAD46.1 68.53,10.13 68.53,10.16
N$5
  Bottom 0.61: PAD106.1 PAD107.1 35.56,21.72 PAD108.1
  Bottom 0.762: PAD107.1 35.71,21.72 35.56,21.72
N$6
  Bottom 0.61: PAD59.1 68.53,22.86 PAD60.1 PAD61.1
  Bottom 0.762: PAD60.1 68.53,22.68 68.53,22.86
N$7
  Bottom 0.61: PAD84.1 PAD83.1 38.1,13.03 PAD85.1
  Bottom 0.762: PAD83.1 38.12,13.03 38.1,13.03
N$8
  Bottom 0.61: PAD92.1 PAD93.1 40.64,13.03 PAD94.1
  Bottom 0.762: PAD93.1 40.54,13.03 40.64,13.03
N$9
  Bottom 0.61: PAD101.1 33.02,21.72 PAD102.1 PAD103.1
  Bottom 0.762: PAD102.1 33.3,21.72 33.02,21.72
N$10
  Bottom 0.61: PAD112.1 PAD111.1 35.56,13.03 PAD110.1
  Bottom 0.762: PAD111.1 35.71,13.03 35.56,13.03
N$11
  Bottom 0.61: PAD117.1 43.18,21.72 PAD115.1 PAD116.1
  Bottom 0.762: PAD115.1 43.43,21.72 43.18,21.72
N$12
  Bottom 0.61: PAD126.1 PAD125.1 53.34,13.03 PAD124.1
  Bottom 0.762: PAD125.1 53.57,13.03 53.34,13.03
N$13
  Bottom 0.61: PAD133.1 PAD134.1 55.88,21.72 PAD135.1
  Bottom 0.762: PAD134.1 55.98,21.72 55.88,21.72
N$14
  Bottom 0.61: PAD144.1 PAD143.1 58.42,13.03 PAD142.1
  Bottom 0.762: PAD143.1 58.4,13.03 58.42,13.03
N$15
  Bottom 0.61: PAD152.1 PAD151.1 60.96,21.72 PAD153.1
  Bottom 0.762: PAD151.1 60.81,21.72 60.96,21.72
N$16
  Bottom 0.61: PAD161.1 PAD162.1 45.72,13.03 PAD160.1
  Bottom 0.762: PAD162.1 45.85,13.03 45.72,13.03
N$17
  Bottom 0.61: PAD169.1 PAD170.1 50.8,21.72 PAD171.1
  Bottom 0.762: PAD170.1 50.67,21.72 50.8,21.72
N$18
  Bottom 0.61: PAD179.1 PAD180.1 | 48.26,13.03 PAD178.1
  Bottom 0.762: 48.26,13.03 PAD180.1
N$19
  Bottom 0.61: PAD241.1 6.35,63.5 PAD42.1
N$20
  Bottom 0.61: PAD199.1 PAD200.1 33.02,45.85 PAD201.1 PAD202.1
  Bottom 0.762: PAD200.1 33.3,45.85 33.02,45.85 | 33.3,48.26 PAD201.1
N$21
  Bottom 0.61: PAD210.1 PAD209.1 38.1,36.68 38.1,34.75 PAD211.1 PAD208.1
  Bottom 0.762: PAD211.1 38.12,34.75 38.1,34.75 | 38.1,36.68 38.12,36.68 PAD209.1
N$22
  Bottom 0.61: PAD220.1 PAD219.1 35.56,34.75 35.56,36.68 PAD217.1 PAD218.1
  Bottom 0.762: PAD219.1 35.71,34.75 35.56,34.75 | 35.56,36.68 35.71,36.68 PAD217.1
N$23
  Bottom 0.61: PAD68.1 PAD67.1 68.53,15.24 PAD66.1
  Bottom 0.762: PAD67.1 68.53,15.44 68.53,15.24
N$24
  Bottom 0.61: PAD74.1 PAD75.1 68.53,20.32 PAD73.1
  Bottom 0.762: PAD75.1 68.53,20.27 68.53,20.32
N$25
  Bottom 0.61: PAD242.1 5.08,55.88 7.62,58.42 PAD41.1
N$26
  Bottom 0.61: PAD132.1 PAD122.1 2.54,45.85 PAD123.1 PAD131.1
  Bottom 0.762: PAD123.1 2.41,45.85 2.54,45.85 | 2.41,48.26 PAD122.1
N$27
  Bottom 0.61: PAD39.1 5.08,71.12 PAD243.1
N$28
  Bottom 0.61: PAD244.1 PAD15.1
N$29
  Bottom 0.61: PAD763.1 PAD764.1 25.4,45.85 PAD765.1 PAD762.1
  Bottom 0.762: PAD765.1 25.58,45.85 25.4,45.85 | 25.58,48.26 PAD764.1
N$30
  Top 0.61: PAD766.1 27.94,42.55
  Bottom 0.61: PAD769.1 PAD768.1 27.94,45.85 PAD767.1 PAD766.1
  Bottom 0.762: PAD767.1 27.99,45.85 27.94,45.85 | 27.99,48.26 PAD768.1
N$34
  Bottom 0.61: PAD176.1 PAD168.1 43.18,36.68 43.18,34.75 PAD177.1 PAD167.1
  Bottom 0.762: PAD177.1 43.43,34.75 43.18,34.75 | 43.18,36.68 43.43,36.68 PAD168.1
N$42
  Bottom 0.61: PAD79.1 38.1,21.72 PAD80.1 PAD81.1
  Bottom 0.762: PAD80.1 38.12,21.72 38.1,21.72
N$43
  Bottom 0.61: PAD90.1 PAD89.1 40.64,21.72 PAD88.1
  Bottom 0.762: PAD89.1 40.54,21.72 40.64,21.72
N$44
  Bottom 0.61: PAD119.1 PAD120.1 43.18,13.03 PAD121.1
  Bottom 0.762: PAD120.1 43.43,13.03 43.18,13.03
N$45
  Bottom 0.61: PAD203.1 PAD195.1 45.72,45.85 PAD204.1 PAD212.1
  Bottom 0.762: PAD204.1 45.85,45.85 45.72,45.85 | 45.85,48.26 PAD195.1
N$46
  Bottom 0.61: PAD254.1 PAD253.1 25.4,81.56 PAD252.1 25.4,83.97 PAD251.1 25.4,86.39 PAD250.1
  Bottom 0.762: PAD253.1 25.58,81.56 25.4,81.56 | 25.4,83.97 25.58,83.97 PAD252.1 | PAD251.1 25.58,86.39 25.4,86.39
N$47
  Top 0.61: PAD398.1 10.16,41.91 10.59,41.48 10.79,41.27
  Top 0.762: X1.14 13.03,38.12 13.03,39.09 10.62,41.5 10.59,41.48
  Bottom 0.61: PAD401.1 PAD400.1 10.16,45.85 PAD399.1 PAD398.1
  Bottom 0.762: PAD399.1 10.13,45.85 10.16,45.85 | 10.13,48.26 PAD400.1
N$48
  Top 0.762: X1.13 15.44,38.12 15.44,40.54 13.03,42.95 PAD404.1
  Bottom 0.61: PAD405.1 PAD402.1 12.7,45.85 PAD403.1 PAD404.1
  Bottom 0.762: PAD403.1 12.55,45.85 12.7,45.85 | 12.55,48.26 PAD402.1
N$49
  Bottom 0.61: PAD226.1 PAD223.1 | 48.26,36.68 48.26,34.75 | PAD225.1 PAD224.1
  Bottom 0.762: 48.26,34.75 PAD225.1 | 48.26,36.68 PAD223.1
N$50
  Bottom 0.61: PAD233.1 PAD230.1 50.8,45.85 PAD231.1 PAD232.1
  Bottom 0.762: PAD231.1 50.67,45.85 50.8,45.85 | 50.67,48.26 PAD230.1
N$51
  Bottom 0.61: PAD237.1 PAD240.1 53.34,36.68 53.34,34.75 PAD239.1 PAD238.1
  Bottom 0.762: PAD239.1 53.57,34.75 53.34,34.75 | 53.34,36.68 53.57,36.68 PAD240.1
N$52
  Top 0.61: 15.24,42.55 PAD406.1
  Top 0.762: X1.12 17.37,38.12 17.37,40.54 15.44,42.47 PAD406.1
  Bottom 0.61: PAD409.1 PAD408.1 15.24,45.85 PAD407.1 PAD406.1
  Bottom 0.762: PAD407.1 15.44,45.85 15.24,45.85 | 15.44,48.26 PAD408.1
N$53
  Top 0.61: PAD411.1 17.78,42.55
  Top 0.762: X1.11 19.3,38.12 19.3,41.02 17.86,42.47 PAD411.1
  Bottom 0.61: PAD410.1 PAD412.1 17.78,45.85 PAD413.1 PAD411.1
  Bottom 0.762: PAD413.1 17.86,45.85 17.78,45.85 | 17.86,48.26 PAD412.1
N$54
  Top 0.61: PAD417.1 20.32,41.99 20.32,41.91
  Top 0.762: X1.10 21.23,38.12 21.23,41.02 20.27,41.99 20.32,41.99
  Bottom 0.61: PAD419.1 PAD622.1 20.32,45.85 PAD418.1 PAD417.1
  Bottom 0.762: 20.27,48.26 PAD622.1 | PAD418.1 20.27,45.85 20.32,45.85
N$55
  Bottom 0.61: PAD623.1 PAD624.1 22.86,45.85 PAD625.1 PAD626.1
  Bottom 0.762: PAD625.1 22.68,45.85 22.86,45.85 | 22.68,48.26 PAD624.1
N$56
  Top 0.61: PAD642.1 15.24,18.82 15.24,19.05
  Top 0.762: X1.5 17.37,22.68 17.37,20.75 15.44,18.82 15.24,18.82
  Bottom 0.61: PAD641.1 PAD640.1 15.24,13.03 PAD639.1 15.24,15.44 PAD642.1
  Bottom 0.762: PAD640.1 15.44,13.03 15.24,13.03 | PAD639.1 15.44,15.44 15.24,15.44
N$57
  Bottom 0.61: PAD761.1 PAD760.1 22.86,13.03 22.86,14.96 PAD759.1 PAD758.1
  Bottom 0.762: PAD760.1 22.68,13.03 22.86,13.03 | 22.86,14.96 22.68,14.96 PAD759.1
N$59
  Bottom 0.61: PAD358.1 PAD367.1 55.88,34.75 55.88,36.68 PAD357.1 PAD366.1
  Bottom 0.762: PAD367.1 55.98,34.75 55.88,34.75 | 55.88,36.68 55.98,36.68 PAD357.1
N$60
  Bottom 0.61: PAD395.1 PAD414.1 58.42,36.68 58.42,34.75 PAD415.1 PAD390.1
  Bottom 0.762: PAD415.1 58.4,34.75 58.42,34.75 | 58.42,36.68 58.4,36.68 PAD414.1
N$61
  Bottom 0.61: PAD458.1 PAD438.1 60.96,34.75 60.96,36.68 PAD463.1 PAD457.1
  Bottom 0.762: PAD438.1 60.81,34.75 60.96,34.75 | 60.96,36.68 60.81,36.68 PAD463.1
N$63
  Top 0.406: 2.1 16.51,88.9 14.61,87 X3.1
N$64
  Top 0.406: X3.2 16.51,87.63 RJ-3.1
N$65
  Top 0.406: 4.1 16.51,86.36 14.61,84.45 X3.3
N$66
  Bottom 0.61: PAD495.1 15.24,69.01 PAD494.1 15.24,66.12 PAD493.1 15.24,63.7 PAD491.1 PAD492.1
  Bottom 0.762: PAD491.1 15.44,63.7 15.24,63.7 | 15.24,66.12 15.44,66.12 PAD493.1 | PAD494.1 15.44,69.01 15.24,69.01
N$67
  Bottom 0.61: PAD500.1 PAD499.1 17.78,63.7 PAD498.1 17.78,66.12 PAD501.1 17.78,69.01 PAD502.1
  Bottom 0.762: PAD499.1 17.86,63.7 17.78,63.7 | 17.78,66.12 17.86,66.12 PAD498.1 | PAD501.1 17.86,69.01 17.78,69.01
N$68
  Bottom 0.61: PAD509.1 20.32,69.01 PAD505.1 20.32,66.12 PAD506.1 20.32,63.7 PAD507.1 PAD508.1
  Bottom 0.762: PAD507.1 20.27,63.7 20.32,63.7 | 20.32,66.12 20.27,66.12 PAD506.1 | PAD505.1 20.27,69.01 20.32,69.01
N$69
  Bottom 0.61: PAD513.1 PAD516.1 22.86,63.7 PAD515.1 22.86,66.12 PAD514.1 22.86,69.01 PAD512.1
  Bottom 0.762: PAD516.1 22.68,63.7 22.86,63.7 | 22.86,66.12 22.68,66.12 PAD515.1 | PAD514.1 22.68,69.01 22.86,69.01
N$70
  Bottom 0.61: PAD523.1 25.4,69.01 PAD522.1 25.4,66.12 PAD521.1 25.4,63.7 PAD519.1 PAD520.1
  Bottom 0.762: PAD519.1 25.58,63.7 25.4,63.7 | 25.4,66.12 25.58,66.12 PAD521.1 | PAD522.1 25.58,69.01 25.4,69.01
N$71
  Bottom 0.61: PAD528.1 PAD527.1 27.94,63.7 PAD526.1 27.94,66.12 PAD529.1 27.94,69.01 PAD530.1
  Bottom 0.762: PAD527.1 27.99,63.7 27.94,63.7 | 27.94,66.12 27.99,66.12 PAD526.1 | PAD529.1 27.99,69.01 27.94,69.01
N$72
  Bottom 0.61: PAD537.1 30.48,69.01 PAD533.1 30.48,66.12 PAD534.1 30.48,63.7 PAD535.1 PAD536.1
  Bottom 0.762: PAD535.1 30.4,63.7 30.48,63.7 | 30.48,66.12 30.4,66.12 PAD534.1 | PAD533.1 30.4,69.01 30.48,69.01
N$73
  Bottom 0.61: PAD543.1 PAD544.1 33.02,63.7 PAD541.1 33.02,66.12 PAD542.1 33.02,69.01 PAD540.1
  Bottom 0.762: PAD544.1 33.3,63.7 33.02,63.7 | 33.02,66.12 33.3,66.12 PAD541.1 | PAD542.1 32.82,69.01 33.02,69.01
N$74
  Bottom 0.61: PAD549.1 35.56,69.01 PAD548.1 35.56,66.12 PAD547.1 35.56,63.7 PAD551.1 PAD550.1
  Bottom 0.762: PAD551.1 35.71,63.7 35.56,63.7 | 35.56,66.12 35.71,66.12 PAD547.1 | PAD548.1 35.71,69.01 35.56,69.01
N$75
  Bottom 0.61: PAD554.1 PAD555.1 38.1,63.7 PAD556.1 38.1,66.12 PAD557.1 38.1,69.01 PAD558.1
  Bottom 0.762: PAD555.1 38.12,63.7 38.1,63.7 | 38.1,66.12 38.12,66.12 PAD556.1 | PAD557.1 38.12,69.01 38.1,69.01
N$76
  Bottom 0.61: PAD565.1 40.64,69.01 PAD564.1 40.64,66.12 PAD563.1 40.64,63.7 PAD562.1 PAD561.1
  Bottom 0.762: PAD562.1 40.54,63.7 40.64,63.7 | 40.64,66.12 40.54,66.12 PAD563.1 | PAD564.1 40.54,69.01 40.64,69.01
N$77
  Bottom 0.61: PAD570.1 PAD571.1 43.18,63.7 PAD572.1 43.18,66.12 PAD568.1 43.18,69.01 PAD569.1
  Bottom 0.762: PAD571.1 43.43,63.7 43.18,63.7 | 43.18,66.12 43.43,66.12 PAD572.1 | PAD568.1 43.43,69.01 43.18,69.01
N$78
  Bottom 0.61: PAD576.1 45.72,69.01 PAD575.1 45.72,66.12 PAD578.1 45.72,63.7 PAD577.1 PAD579.1
  Bottom 0.762: PAD577.1 45.85,63.7 45.72,63.7 | 45.72,66.12 45.85,66.12 PAD578.1 | PAD575.1 45.85,69.01 45.72,69.01
N$79
  Bottom 0.61: PAD586.1 PAD582.1 | 48.26,63.7 PAD583.1 | 48.26,66.12 PAD584.1 | 48.26,69.01 PAD585.1
  Bottom 0.762: 48.26,63.7 PAD582.1 | 48.26,66.12 PAD583.1 | 48.26,69.01 PAD584.1
N$80
  Bottom 0.61: PAD593.1 50.8,69.01 PAD592.1 50.8,66.12 PAD591.1 50.8,63.7 PAD590.1 PAD589.1
  Bottom 0.762: PAD590.1 50.67,63.7 50.8,63.7 | 50.8,66.12 50.67,66.12 PAD591.1 | PAD592.1 50.67,69.01 50.8,69.01
N$81
  Bottom 0.61: PAD597.1 PAD598.1 53.34,63.7 PAD599.1 53.34,66.12 PAD600.1 53.34,69.01 PAD596.1
  Bottom 0.762: PAD598.1 53.57,63.7 53.34,63.7 | 53.34,66.12 53.57,66.12 PAD599.1 | PAD600.1 53.57,69.01 53.34,69.01
N$82
  Bottom 0.61: PAD603.1 55.88,69.01 PAD605.1 55.88,66.12 PAD604.1 55.88,63.7 PAD607.1 PAD606.1
  Bottom 0.762: PAD607.1 55.98,63.7 55.88,63.7 | 55.88,66.12 55.98,66.12 PAD604.1 | PAD605.1 55.98,69.01 55.88,69.01
N$83
  Bottom 0.61: PAD614.1 PAD611.1 58.42,63.7 PAD610.1 58.42,66.12 PAD612.1 58.42,69.01 PAD613.1
  Bottom 0.762: PAD611.1 58.4,63.7 58.42,63.7 | 58.42,66.12 58.4,66.12 PAD610.1 | PAD612.1 58.4,69.01 58.42,69.01
N$84
  Top 0.406: X3.4 16.51,85.09 5.1
N$86
  Bottom 0.61: PAD778.1 PAD779.1 27.94,13.03 27.94,14.96 PAD780.1 PAD781.1
  Bottom 0.762: PAD779.1 27.99,13.03 27.94,13.03 | 27.94,14.96 27.99,14.96 PAD780.1
N$87
  Top 0.61: PAD770.1 5.08,20.27 5.08,20.32
  Top 0.762: 5.08,20.27 6.76,20.27 9.17,22.68 X1.1
  Bottom 0.61: PAD771.1 PAD772.1 PAD773.1 PAD770.1
N$88
  Top 0.61: 7.62,19.05 PAD628.1
  Top 0.762: X1.2 11.1,22.68 11.1,21.72 7.72,18.34 PAD628.1
  Bottom 0.61: PAD627.1 PAD630.1 PAD629.1 PAD628.1
N$89
  Top 0.406: 6.1 16.51,83.82 14.61,81.92 X3.5
N$90
  Top 0.762: X1.4 15.44,22.68 15.44,20.75 12.55,17.86 PAD635.1
  Bottom 0.61: PAD637.1 PAD638.1 12.7,13.03 PAD636.1 12.7,15.44 PAD635.1
  Bottom 0.762: PAD638.1 12.55,13.03 12.7,13.03 | PAD636.1 12.55,15.44 12.7,15.44
N$91
  Top 0.762: X1.6 19.3,22.68 19.3,19.79 17.37,17.86 PAD745.1
  Bottom 0.61: PAD742.1 PAD743.1 17.78,13.03 PAD744.1 17.78,15.44 PAD745.1
  Bottom 0.762: PAD743.1 17.86,13.03 17.78,13.03 | PAD744.1 17.86,15.44 17.78,15.44
N$92
  Bottom 0.61: PAD648.1 PAD644.1 58.42,81.56 PAD645.1 58.42,83.97 PAD646.1 58.42,86.39 PAD647.1
  Bottom 0.762: PAD644.1 58.4,81.56 58.42,81.56 | 58.42,83.97 58.4,83.97 PAD645.1 | PAD646.1 58.4,86.39 58.42,86.39
N$93
  Bottom 0.61: PAD653.1 55.88,86.39 PAD652.1 55.88,83.97 PAD651.1 55.88,81.56 PAD654.1 PAD655.1
  Bottom 0.762: PAD654.1 55.98,81.56 55.88,81.56 | 55.88,83.97 55.98,83.97 PAD651.1 | PAD652.1 55.98,86.39 55.88,86.39
N$94
  Bottom 0.61: PAD659.1 53.34,86.39 PAD658.1 53.34,83.97 PAD660.1 53.34,81.56 PAD661.1 PAD662.1
  Bottom 0.762: PAD661.1 53.57,81.56 53.34,81.56 | 53.34,83.97 53.57,83.97 PAD660.1 | PAD658.1 53.57,86.39 53.34,86.39
N$95
  Bottom 0.61: PAD668.1 PAD669.1 50.8,81.56 PAD667.1 50.8,83.97 PAD666.1 50.8,86.39 PAD665.1
  Bottom 0.762: PAD669.1 50.67,81.56 50.8,81.56 | 50.8,83.97 50.67,83.97 PAD667.1 | PAD666.1 50.67,86.39 50.8,86.39
N$96
  Bottom 0.61: PAD672.1 48.26,86.39 | PAD673.1 48.26,83.97 | PAD676.1 48.26,81.56 | PAD675.1 PAD674.1
  Bottom 0.762: 48.26,81.56 PAD675.1 | 48.26,83.97 PAD676.1 | 48.26,86.39 PAD673.1
N$97
  Bottom 0.61: PAD680.1 PAD681.1 45.72,81.56 PAD682.1 45.72,83.97 PAD683.1 45.72,86.39 PAD679.1
  Bottom 0.762: PAD681.1 45.85,81.56 45.72,81.56 | 45.72,83.97 45.85,83.97 PAD682.1 | PAD683.1 45.85,86.39 45.72,86.39
N$98
  Bottom 0.61: PAD689.1 43.18,86.39 PAD688.1 43.18,83.97 PAD687.1 43.18,81.56 PAD686.1 PAD690.1
  Bottom 0.762: PAD686.1 43.43,81.56 43.18,81.56 | 43.18,83.97 43.43,83.97 PAD687.1 | PAD688.1 43.43,86.39 43.18,86.39
N$99
  Bottom 0.61: PAD697.1 PAD696.1 40.64,81.56 PAD693.1 40.64,83.97 PAD694.1 40.64,86.39 PAD695.1
  Bottom 0.762: PAD696.1 40.54,81.56 40.64,81.56 | 40.64,83.97 40.54,83.97 PAD693.1 | PAD694.1 40.54,86.39 40.64,86.39
N$100
  Bottom 0.61: PAD701.1 38.1,86.39 PAD700.1 38.1,83.97 PAD702.1 38.1,81.56 PAD703.1 PAD704.1
  Bottom 0.762: PAD703.1 38.12,81.56 38.1,81.56 | 38.1,83.97 38.12,83.97 PAD702.1 | PAD700.1 38.12,86.39 38.1,86.39
N$101
  Bottom 0.61: PAD710.1 PAD709.1 35.56,81.56 PAD711.1 35.56,83.97 PAD708.1 35.56,86.39 PAD707.1
  Bottom 0.762: PAD709.1 35.71,81.56 35.56,81.56 | 35.56,83.97 35.71,83.97 PAD711.1 | PAD708.1 35.71,86.39 35.56,86.39
N$102
  Top 0.406: X3.6 16.51,82.55 7.1
N$103
  Top 0.406: X3.7 15.88,79.38 8.1
N$104
  Top 0.406: X3.8 18.41,78.11 1.1
N$105
  Bottom 0.61: PAD518.1 22.86,86.39 PAD524.1 22.86,83.97 PAD531.1 22.86,81.56 PAD532.1 PAD538.1
  Bottom 0.762: PAD532.1 22.68,81.56 22.86,81.56 | 22.86,83.97 22.68,83.97 PAD531.1 | PAD524.1 22.68,86.39 22.86,86.39
N$107
  Bottom 0.61: PAD573.1 PAD567.1 PAD566.1 PAD560.1
N$108
  Bottom 0.61: PAD656.1 62.23,85.09 66.04,88.9 PAD756.1
N$109
  Top 0.61: PAD755.1 64.77,63.5 PAD657.1
N$110
  Bottom 0.61: PAD716.1 33.02,86.39 PAD718.1 33.02,83.97 PAD717.1 33.02,81.56 PAD714.1 PAD715.1
  Bottom 0.762: PAD714.1 33.3,81.56 33.02,81.56 | 33.02,83.97 33.3,83.97 PAD717.1 | PAD718.1 33.3,86.39 33.02,86.39
N$111
  Bottom 0.61: PAD724.1 PAD722.1 30.48,81.56 PAD723.1 30.48,83.97 PAD721.1 30.48,86.39 PAD725.1
  Bottom 0.762: PAD722.1 30.4,81.56 30.48,81.56 | 30.48,83.97 30.4,83.97 PAD723.1 | PAD721.1 30.4,86.39 30.48,86.39
N$112
  Bottom 0.61: PAD731.1 27.94,86.39 PAD732.1 27.94,83.97 PAD728.1 27.94,81.56 PAD729.1 PAD730.1
  Bottom 0.762: PAD729.1 27.99,81.56 27.94,81.56 | 27.94,83.97 27.99,83.97 PAD728.1 | PAD732.1 27.99,86.39 27.94,86.39
N$113
  Top 0.762: X1.3 13.03,22.68 13.03,20.27 10.62,17.86 PAD631.1
  Bottom 0.61: PAD634.1 PAD633.1 10.16,13.03 PAD632.1 10.16,15.44 PAD631.1
  Bottom 0.762: PAD633.1 10.13,13.03 10.16,13.03 | PAD632.1 10.13,15.44 10.16,15.44
N$114
  Bottom 0.61: PAD663.1 64.77,81.28 67.31,83.82 PAD754.1
N$115
  Bottom 0.61: PAD664.1 PAD753.1
N$116
  Top 0.61: PAD752.1 64.77,73.66 PAD670.1
N$117
  Top 0.61: PAD751.1 PAD671.1
N$118
  Bottom 0.61: PAD64.1 PAD65.1 68.53,25.4 PAD63.1
  Bottom 0.762: PAD65.1 68.53,25.58 68.53,25.4
N$119
  Bottom 0.61: PAD86.1 68.53,17.78 PAD77.1 PAD78.1
  Bottom 0.762: PAD77.1 68.53,17.86 68.53,17.78
N$120
  Bottom 0.61: PAD72.1 68.53,12.7 PAD71.1 PAD70.1
  Bottom 0.762: PAD71.1 68.53,12.55 68.53,12.7
N$121
  Top 0.61: 20.32,19.05 PAD748.1
  Top 0.762: X1.7 21.23,22.68 21.23,20.27 20.27,19.3 20.32,19.05
  Bottom 0.61: PAD749.1 PAD746.1 20.32,13.03 20.32,14.96 PAD747.1 PAD748.1
  Bottom 0.762: 20.32,14.96 20.27,14.96 PAD747.1 | PAD746.1 20.27,13.03 20.32,13.03
N$122
  Bottom 0.61: PAD776.1 PAD775.1 25.4,13.03 25.4,14.96 PAD774.1 PAD777.1
  Bottom 0.762: PAD775.1 25.58,13.03 25.4,13.03 | 25.4,14.96 25.58,14.96 PAD774.1
N$125
  Bottom 0.61: PAD164.1 PAD165.1 45.72,21.72 PAD166.1
  Bottom 0.762: PAD165.1 45.85,21.72 45.72,21.72
N$126
  Bottom 0.61: PAD184.1 48.26,21.72 | PAD183.1 PAD182.1
  Bottom 0.762: 48.26,21.72 PAD183.1
N$127
  Bottom 0.61: PAD173.1 50.8,13.03 PAD175.1 PAD174.1
  Bottom 0.762: PAD175.1 50.67,13.03 50.8,13.03
N$128
  Bottom 0.61: PAD128.1 53.34,21.72 PAD129.1 PAD130.1
  Bottom 0.762: PAD129.1 53.57,21.72 53.34,21.72
N$129
  Bottom 0.61: PAD137.1 55.88,13.03 PAD139.1 PAD138.1
  Bottom 0.762: PAD139.1 55.98,13.03 55.88,13.03
N$130
  Bottom 0.61: PAD146.1 58.42,21.72 PAD147.1 PAD148.1
  Bottom 0.762: PAD147.1 58.4,21.72 58.42,21.72
N$131
  Bottom 0.61: PAD155.1 60.96,13.03 PAD157.1 PAD156.1
  Bottom 0.762: PAD157.1 60.81,13.03 60.96,13.03
N$133
  Bottom 0.61: PAD581.1 PAD216.1 35.56,45.85 PAD214.1 PAD215.1
  Bottom 0.762: PAD214.1 35.71,45.85 35.56,45.85 | 35.71,48.26 PAD216.1
N$134
  Bottom 0.61: PAD205.1 PAD206.1 38.1,45.85 PAD207.1 PAD580.1
  Bottom 0.762: PAD206.1 38.12,45.85 38.1,45.85 | 38.12,48.26 PAD207.1
N$135
  Bottom 0.61: PAD587.1 PAD2.1 40.64,45.85 PAD1.1 PAD3.1
  Bottom 0.762: PAD1.1 40.54,45.85 40.64,45.85 | 40.54,48.26 PAD2.1
N$136
  Bottom 0.61: PAD159.1 PAD158.1 43.18,45.85 PAD150.1 PAD588.1
  Bottom 0.762: PAD158.1 43.43,45.85 43.18,45.85 | 43.43,48.26 PAD150.1
N$137
  Bottom 0.61: PAD185.1 PAD194.1 45.72,34.75 45.72,36.68 PAD186.1 PAD594.1
  Bottom 0.762: PAD194.1 45.85,34.75 45.72,34.75 | 45.72,36.68 45.85,36.68 PAD186.1
N$138
  Bottom 0.61: PAD221.1 PAD222.1 | 48.26,45.85 PAD213.1 PAD595.1
  Bottom 0.762: 48.26,45.85 PAD222.1
N$139
  Bottom 0.61: PAD229.1 PAD228.1 50.8,34.75 50.8,36.68 PAD227.1 PAD601.1
  Bottom 0.762: PAD228.1 50.67,34.75 50.8,34.75 | 50.8,36.68 50.67,36.68 PAD227.1
N$140
  Bottom 0.61: PAD235.1 PAD236.1 53.34,45.85 PAD234.1 PAD602.1
  Bottom 0.762: PAD236.1 53.57,45.85 53.34,45.85 | 53.57,48.26 PAD234.1
N$141
  Bottom 0.61: PAD608.1 PAD340.1 55.88,45.85 PAD349.1 PAD348.1
  Bottom 0.762: PAD349.1 55.98,45.85 55.88,45.85 | 55.98,48.26 PAD340.1
N$142
  Bottom 0.61: PAD384.1 PAD376.1 58.42,45.85 PAD375.1 PAD609.1
  Bottom 0.762: PAD376.1 58.4,45.85 58.42,45.85 | 58.4,48.26 PAD375.1
N$143
  Bottom 0.61: PAD615.1 PAD437.1 60.96,45.85 PAD420.1 PAD416.1
  Bottom 0.762: PAD420.1 60.81,45.85 60.96,45.85 | 60.81,48.26 PAD437.1
N$145
  Bottom 0.61: PAD198.1 PAD197.1 33.02,36.68 33.02,34.75 PAD196.1 PAD574.1
  Bottom 0.762: PAD196.1 33.3,34.75 33.02,34.75 | 33.02,36.68 33.3,36.68 PAD197.1
N$146
  Bottom 0.61: PAD53.1 10.16,69.01 PAD48.1 10.16,66.12 PAD55.1 10.16,63.7 PAD62.1 PAD52.1
  Bottom 0.762: PAD62.1 10.13,63.7 10.16,63.7 | 10.16,66.12 10.13,66.12 PAD55.1 | PAD48.1 10.13,69.01 10.16,69.01
N$147
  Bottom 0.61: PAD76.1 PAD91.1 12.7,63.7 PAD82.1 12.7,66.12 PAD69.1 12.7,69.01 PAD100.1
  Bottom 0.762: PAD91.1 12.55,63.7 12.7,63.7 | 12.7,66.12 12.55,66.12 PAD82.1 | PAD69.1 12.55,69.01 12.7,69.01
RX  (via drill 0.6)
  Top 0.61: PAD267.1 7.62,41.27
  Top 0.762: 7.62,41.27 7.72,41.02 9.17,41.02 11.1,39.09 11.1,38.12 X1.15 11.58,37.64 11.58,36.68 v15.24,33.02
  Bottom 0.61: PAD268.1 PAD396.1 7.62,45.85 PAD397.1 PAD267.1
  Bottom 0.762: PAD397.1 7.72,45.85 7.62,45.85 | 7.72,48.26 PAD396.1 | RX.1 38.73,26.04 22.23,26.04 v15.24,33.02
TX  (via drill 0.51)
  Top 0.762: PAD256.1 5.31,42.95 5.31,41.99 9.17,38.12 X1.16 9.53,37.92 9.53,34.92 v11.43,33.02 | TX.1 43.18,28.57 41.91,29.84 v29.21,29.84
  Bottom 0.61: PAD259.1 PAD258.1 5.08,45.85 PAD257.1 PAD256.1
  Bottom 0.762: PAD257.1 5.31,45.85 5.08,45.85 | 5.31,48.26 PAD258.1 | v29.21,29.84 14.61,29.84 v11.43,33.02
VCC
  Top 0.406: DC.1 67.37,36.2 | 67.37,36.2 67.37,41.45 68.21,42.28 | 68.21,42.28 X2.VBUS | MIC5502.1 72.07,35.88 71.75,36.2 69.85,36.2 | 69.85,36.2 67.37,36.2 | MIC5502.3 70.17,35.88 69.85,36.2 | 5V.1 66.04,44.45 68.21,42.28
  Top 0.61: 5V.1 66.04,51.41 J1.1
VDD  (1 unrouted)
  Top 0.406: MIC5502.5 72.07,31.43 71.12,30.48 67.44,30.48 DC.3
  Top 0.61: PAD794.1 63.5,27.94 65.8,30.24 66.04,30.48 67.3,30.48 DC.3 | 62.23,52.07 61.77,52.07 61.59,52.07 | 59.05,54.61 PAD503.1
  Top 0.762: 61.77,52.07 61.77,52.12 58.88,55.02 PAD503.1 | 23.65,23.16 X1.8 | 65.8,30.24 64.19,31.85 64.19,50.19 62.26,52.12 62.23,52.07
  Bottom 0.61: PAD617.1 PAD444.1 5.31,6.35 PAD450.1 7.72,6.35 10.13,6.35 PAD453.1 12.55,6.35 PAD456.1 PAD459.1 15.44,6.35 PAD462.1 17.86,6.35 20.27,6.35 PAD461.1 PAD460.1 23.16,6.35 PAD442.1 25.58,6.35 PAD455.1 27.99,6.35 30.4,6.35 PAD452.1 PAD449.1 33.3,6.35 PAD446.1 35.71,6.35 PAD443.1 38.12,6.35 40.54,6.35 PAD445.1 PAD454.1 43.43,6.35 PAD451.1 45.85,6.35 PAD448.1 50.67,6.35 PAD294.1 PAD295.1 53.57,6.35 PAD303.1 55.98,6.35 58.4,6.35 PAD304.1 60.81,6.35 PAD792.1 PAD794.1 63.7,6.35 PAD618.1 66.12,6.35 PAD793.1 | PAD503.1 55.98,54.61 PAD488.1 53.57,54.61 PAD483.1 PAD482.1 50.67,54.61 PAD487.1 45.85,54.61 PAD497.1 43.43,54.61 PAD490.1 PAD480.1 40.54,54.61 38.12,54.61 PAD517.1 PAD481.1 35.23,54.61 33.3,54.61 PAD486.1 PAD496.1 30.4,54.61 27.99,54.61 PAD511.1 25.58,54.61 PAD539.1 23.16,54.61 PAD485.1 PAD484.1 20.27,54.61 17.86,54.61 PAD489.1 15.44,54.61 PAD504.1 PAD510.1 12.55,54.61 PAD109.1 | PAD650.1 PAD14.1 5.31,92.71 PAD13.1 7.72,92.71 10.13,92.71 PAD20.1 12.55,92.71 PAD11.1 PAD6.1 15.44,92.71 PAD7.1 17.86,92.71 20.27,92.71 PAD8.1 PAD19.1 23.16,92.71 PAD21.1 25.58,92.71 PAD18.1 27.99,92.71 30.4,92.71 PAD649.1 PAD10.1 33.3,92.71 PAD9.1 35.71,92.71 PAD5.1 38.12,92.71 40.54,92.71 PAD16.1 PAD312.1 43.43,92.71 PAD313.1 45.85,92.71 PAD321.1 50.67,92.71 PAD322.1 PAD323.1 53.57,92.71 PAD324.1 55.98,92.71 58.4,92.71 PAD325.1 60.81,92.71 PAD784.1 PAD785.1 63.7,92.71 PAD786.1 66.12,92.71 PAD787.1
  Bottom 0.762: PAD14.1 5.31,92.66 5.31,92.71 | 35.71,92.71 35.71,92.66 PAD9.1 | PAD13.1 7.72,92.66 7.72,92.71 | PAD20.1 10.13,92.66 10.13,92.71 | PAD11.1 12.55,92.66 12.55,92.71 | PAD6.1 15.44,92.66 15.44,92.71 | PAD7.1 17.86,92.66 17.86,92.71 | PAD8.1 20.27,92.66 20.27,92.71 | PAD19.1 23.16,92.66 23.16,92.71 | PAD21.1 25.58,92.66 25.58,92.71 | PAD18.1 27.99,92.66 27.99,92.71 | PAD649.1 30.4,92.66 30.4,92.71 | PAD10.1 33.3,92.66 33.3,92.71 | PAD5.1 38.12,92.66 38.12,92.71 | PAD16.1 40.54,92.66 40.54,92.71 | PAD312.1 43.43,92.66 43.43,92.71 | PAD313.1 45.85,92.66 45.85,92.71 | 48.26,92.66 PAD321.1 | PAD322.1 50.67,92.66 50.67,92.71 | PAD323.1 53.57,92.66 53.57,92.71 | PAD324.1 55.98,92.66 55.98,92.71 | PAD325.1 58.4,92.66 58.4,92.71 | 60.81,92.66 60.81,92.71 | PAD785.1 63.7,92.66 63.7,92.71 | PAD786.1 66.12,92.66 66.12,92.71 | 35.23,54.61 35.23,54.53 PAD481.1 | PAD510.1 12.55,54.53 12.55,54.61 | PAD504.1 15.44,54.53 15.44,54.61 | PAD489.1 17.86,54.53 17.86,54.61 | PAD484.1 20.27,54.53 20.27,54.61 | PAD485.1 23.16,54.53 23.16,54.61 | PAD539.1 25.58,54.53 25.58,54.61 | PAD511.1 27.99,54.53 27.99,54.61 | PAD496.1 30.4,54.53 30.4,54.61 | PAD486.1 33.3,54.53 33.3,54.61 | PAD517.1 38.12,54.53 38.12,54.61 | PAD480.1 40.54,54.53 40.54,54.61 | PAD490.1 43.43,54.53 43.43,54.61 | PAD497.1 45.85,54.53 45.85,54.61 | 48.26,54.53 PAD487.1 | PAD482.1 50.67,54.53 50.67,54.61 | PAD483.1 53.57,54.53 53.57,54.61 | PAD488.1 55.98,54.53 55.98,54.61 | 30.4,6.35 30.4,6.27 PAD452.1 30.48,19.05 23.5,23.5 | PAD444.1 5.31,6.27 5.31,6.35 | PAD450.1 7.72,6.27 7.72,6.35 | PAD453.1 10.13,6.27 10.13,6.35 | PAD456.1 12.55,6.27 12.55,6.35 | PAD459.1 15.44,6.27 15.44,6.35
  Bottom 0.762: PAD462.1 17.86,6.27 17.86,6.35 | PAD461.1 20.27,6.27 20.27,6.35 | PAD460.1 23.16,6.27 23.16,6.35 | PAD442.1 25.58,6.27 25.58,6.35 | PAD455.1 27.99,6.27 27.99,6.35 | PAD449.1 33.3,6.27 33.3,6.35 | PAD446.1 35.71,6.27 35.71,6.35 | PAD443.1 38.12,6.27 38.12,6.35 | PAD445.1 40.54,6.27 40.54,6.35 | PAD454.1 43.43,6.27 43.43,6.35 | PAD451.1 45.85,6.27 45.85,6.35 | 48.26,6.27 PAD448.1 | PAD294.1 50.67,6.27 50.67,6.35 | PAD295.1 53.57,6.27 53.57,6.35 | PAD303.1 55.98,6.27 55.98,6.35 | PAD304.1 58.4,6.27 58.4,6.35 | PAD792.1 60.81,6.27 60.81,6.35 | PAD618.1 66.12,6.27 66.12,6.35 | PAD794.1 63.7,6.27 63.7,6.35 | 60.81,92.66 60.81,60.33 63.52,58.88 63.52,55.02 61.29,54.05 59.36,54.05 58.88,54.53 PAD503.1 | 60.81,92.66 PAD784.1

## Text on the board
tNames: MX 3-11-8-ESP12 rev2 | xnsense.no | GND | +3V3 | GND | +3V3 | TX | RX | D5 | D4 | D0 | D2 | D15 | GND | RX | TX | RST | ADC | EN | D16 | D14 | D12 | D13 | +3V3 | GND